# Altium schematic sheet connector.SchDoc
size A4
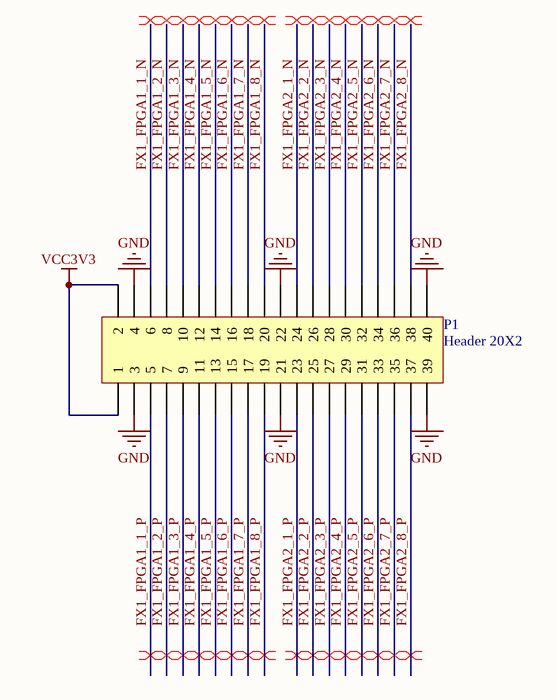
[diagram p0: connector.SchDoc]

## Parts
P1  Header 20X2  [HDR2X20]

## Nets
GND: P1.3 P1.4 P1.21 P1.22 P1.39 P1.40
VCC3V3: P1.1 P1.2
FX1_FPGA1_1_N: P1.6
FX1_FPGA1_1_P: P1.5
FX1_FPGA1_2_N: P1.8
FX1_FPGA1_2_P: P1.7
FX1_FPGA1_3_N: P1.10
FX1_FPGA1_3_P: P1.9
FX1_FPGA1_4_N: P1.12
FX1_FPGA1_4_P: P1.11
FX1_FPGA1_5_N: P1.14
FX1_FPGA1_5_P: P1.13
FX1_FPGA1_6_N: P1.16
FX1_FPGA1_6_P: P1.15
FX1_FPGA1_7_N: P1.18
FX1_FPGA1_7_P: P1.17
FX1_FPGA1_8_N: P1.20
FX1_FPGA1_8_P: P1.19
FX1_FPGA2_1_N: P1.24
FX1_FPGA2_1_P: P1.23
FX1_FPGA2_2_N: P1.26
FX1_FPGA2_2_P: P1.25
FX1_FPGA2_3_N: P1.28
FX1_FPGA2_3_P: P1.27
FX1_FPGA2_4_N: P1.30
FX1_FPGA2_4_P: P1.29
FX1_FPGA2_5_N: P1.32
FX1_FPGA2_5_P: P1.31
FX1_FPGA2_6_N: P1.34
FX1_FPGA2_6_P: P1.33
FX1_FPGA2_7_N: P1.36
FX1_FPGA2_7_P: P1.35
FX1_FPGA2_8_N: P1.38
FX1_FPGA2_8_P: P1.37

## Layout directives
differential pair: FX1_FPGA1_1_N, FX1_FPGA1_1_P, FX1_FPGA1_2_N, FX1_FPGA1_2_P, FX1_FPGA1_3_N, FX1_FPGA1_3_P, FX1_FPGA1_4_N, FX1_FPGA1_4_P, FX1_FPGA1_5_N, FX1_FPGA1_5_P, FX1_FPGA1_6_N, FX1_FPGA1_6_P, FX1_FPGA1_7_N, FX1_FPGA1_7_P, FX1_FPGA1_8_N, FX1_FPGA1_8_P, FX1_FPGA2_1_N, FX1_FPGA2_1_P, FX1_FPGA2_2_N, FX1_FPGA2_2_P, FX1_FPGA2_3_N, FX1_FPGA2_3_P, FX1_FPGA2_4_N, FX1_FPGA2_4_P, FX1_FPGA2_5_N, FX1_FPGA2_5_P, FX1_FPGA2_6_N, FX1_FPGA2_6_P, FX1_FPGA2_7_N, FX1_FPGA2_7_P, FX1_FPGA2_8_N, FX1_FPGA2_8_P

## Library data of the parts
P1 = Header 20X2: Header, 20-Pin, Dual row; LatestRevisionDate: 17-Jul-2002; LatestRevisionNote: Re-released for DXP Platform.; Publisher: Altium Limited